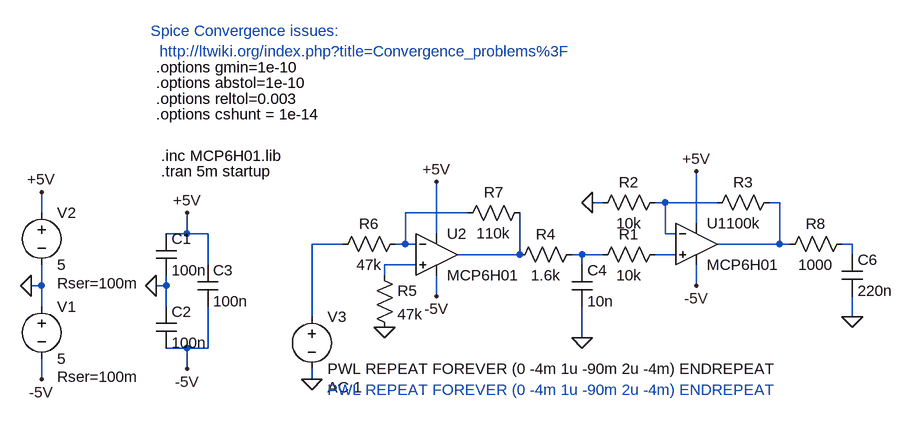
[diagram p0: schematic chargeCurrentSense.asc]
chargeCurrentSense.asc, the LTspice schematic file:
Version 4
SHEET 1 2052 680
WIRE 704 96 688 96
WIRE 800 96 784 96
WIRE 880 96 800 96
WIRE 976 96 960 96
WIRE -160 112 -160 80
WIRE 496 112 400 112
WIRE 848 128 848 48
WIRE 64 144 64 112
WIRE 64 144 32 144
WIRE 96 144 64 144
WIRE 448 144 448 64
WIRE 800 144 800 96
WIRE 816 144 800 144
WIRE 304 160 256 160
WIRE 400 160 400 112
WIRE 400 160 384 160
WIRE 416 160 400 160
WIRE 976 160 976 96
WIRE 976 160 880 160
WIRE 992 160 976 160
WIRE 1088 160 1072 160
WIRE 576 176 576 112
WIRE 576 176 480 176
WIRE 672 176 656 176
WIRE 704 176 672 176
WIRE 816 176 784 176
WIRE 1088 176 1088 160
WIRE 96 192 96 144
WIRE 416 192 368 192
WIRE 672 192 672 176
WIRE 368 208 368 192
WIRE -160 224 -160 192
WIRE -160 224 -176 224
WIRE 32 224 32 208
WIRE 32 224 16 224
WIRE 848 224 848 192
WIRE 448 240 448 208
WIRE -160 256 -160 224
WIRE 32 256 32 224
WIRE 256 272 256 160
WIRE 1088 272 1088 240
WIRE 672 304 672 256
WIRE 64 320 32 320
WIRE 96 320 96 256
WIRE 96 320 64 320
WIRE 64 352 64 320
WIRE -160 368 -160 336
WIRE 256 368 256 352
FLAG -176 224 0
FLAG -160 80 +5V
FLAG -160 368 -5V
FLAG 16 224 0
FLAG 64 112 +5V
FLAG 64 352 -5V
FLAG 848 48 +5V
FLAG 848 224 -5V
FLAG 256 368 0
FLAG 672 304 0
FLAG 688 96 0
FLAG 368 288 0
FLAG 448 64 +5V
FLAG 448 240 -5V
FLAG 1088 272 0
SYMBOL voltage -160 240 R0
WINDOW 123 0 0 Left 0
WINDOW 39 24 124 Left 2
SYMATTR SpiceLine Rser=100m
SYMATTR InstName V1
SYMATTR Value 5
SYMBOL voltage -160 96 R0
WINDOW 123 0 0 Left 0
WINDOW 39 24 124 Left 2
SYMATTR SpiceLine Rser=100m
SYMATTR InstName V2
SYMATTR Value 5
SYMBOL cap 16 144 R0
SYMATTR InstName C1
SYMATTR Value 100n
SYMBOL cap 16 256 R0
SYMATTR InstName C2
SYMATTR Value 100n
SYMBOL cap 80 192 R0
SYMATTR InstName C3
SYMATTR Value 100n
SYMBOL cap 656 192 R0
SYMATTR InstName C4
SYMATTR Value 10n
SYMBOL res 672 160 R90
WINDOW 0 0 56 VBottom 2
WINDOW 3 32 56 VTop 2
SYMATTR InstName R4
SYMATTR Value 1.6k
SYMBOL Opamps\\opamp2 848 96 R0
SYMATTR InstName U1
SYMATTR Value MCP6H01
SYMBOL res 800 160 R90
WINDOW 0 0 56 VBottom 2
WINDOW 3 32 56 VTop 2
SYMATTR InstName R1
SYMATTR Value 10k
SYMBOL res 800 80 R90
WINDOW 0 0 56 VBottom 2
WINDOW 3 32 56 VTop 2
SYMATTR InstName R2
SYMATTR Value 10k
SYMBOL res 976 80 R90
WINDOW 0 0 56 VBottom 2
WINDOW 3 32 56 VTop 2
SYMATTR InstName R3
SYMATTR Value 100k
SYMBOL Opamps\\opamp2 448 112 R0
SYMATTR InstName U2
SYMATTR Value MCP6H01
SYMBOL res 352 192 R0
SYMATTR InstName R5
SYMATTR Value 47k
SYMBOL res 400 144 R90
WINDOW 0 0 56 VBottom 2
WINDOW 3 32 56 VTop 2
SYMATTR InstName R6
SYMATTR Value 47k
SYMBOL res 592 96 R90
WINDOW 0 0 56 VBottom 2
WINDOW 3 32 56 VTop 2
SYMATTR InstName R7
SYMATTR Value 110k
SYMBOL res 1088 144 R90
WINDOW 0 0 56 VBottom 2
WINDOW 3 32 56 VTop 2
SYMATTR InstName R8
SYMATTR Value 1000
SYMBOL cap 1072 176 R0
SYMATTR InstName C6
SYMATTR Value 220n
SYMBOL voltage 256 256 R0
WINDOW 123 24 124 Left 2
WINDOW 39 0 0 Left 0
SYMATTR InstName V3
SYMATTR Value PWL REPEAT FOREVER (0 -4m 1u -90m 2u -4m) ENDREPEAT
SYMATTR Value2 AC 1
TEXT 24 24 Left 2 !.inc MCP6H01.lib
TEXT 24 48 Left 2 !.tran 5m startup
TEXT 16 -40 Left 2 !.options cshunt = 1e-14
TEXT 8 -168 Left 2 ;Spice Convergence issues:\n  http://ltwiki.org/index.php?title=Convergence_problems%3F
TEXT 280 384 Left 2 ;PWL REPEAT FOREVER (0 -4m 1u -90m 2u -4m) ENDREPEAT
TEXT 16 -112 Left 2 !.options gmin=1e-10
TEXT 16 -88 Left 2 !.options abstol=1e-10
TEXT 16 -64 Left 2 !.options reltol=0.003

The netlist it stands for:
* chargeCurrentSense.asc
V1 0 -5V 5 Rser=100m
V2 +5V 0 5 Rser=100m
C1 +5V 0 100n
C2 0 -5V 100n
C3 +5V -5V 100n
C4 N007 0 10n
R4 N007 N006 1.6k
XU1 N008 N001 +5V -5V N002 MCP6H01  ; pins In+ In- V+ V- OUT
R1 N008 N007 10k
R2 N001 0 10k
R3 N002 N001 100k
XU2 N009 N003 +5V -5V N006 MCP6H01  ; pins In+ In- V+ V- OUT
R5 N009 0 47k
R6 N003 N004 47k
R7 N006 N003 110k
R8 N005 N002 1000
C6 N005 0 220n
V3 N004 0 PWL REPEAT FOREVER (0 -4m 1u -90m 2u -4m) ENDREPEAT AC 1
.inc MCP6H01.lib
.tran 5m startup
.options cshunt = 1e-14
* Spice Convergence issues:
*   http://ltwiki.org/index.php?title=Convergence_problems%3F
* PWL REPEAT FOREVER (0 -4m 1u -90m 2u -4m) ENDREPEAT
.options gmin=1e-10
.options abstol=1e-10
.options reltol=0.003
.backanno
.end